# Altium schematic sheet TSevenSegmentDisplay.SchDoc: LiveDesign Evaluation - Alarm Clock
size A2; Organization: Altium Limited; Address1: L3, 12a Rodborough Rd; Address2: Frenchs Forest; Address3: NSW; Address4: Australia 2086; DocumentNumber: 9; SheetNumber: 9; SheetTotal: 10
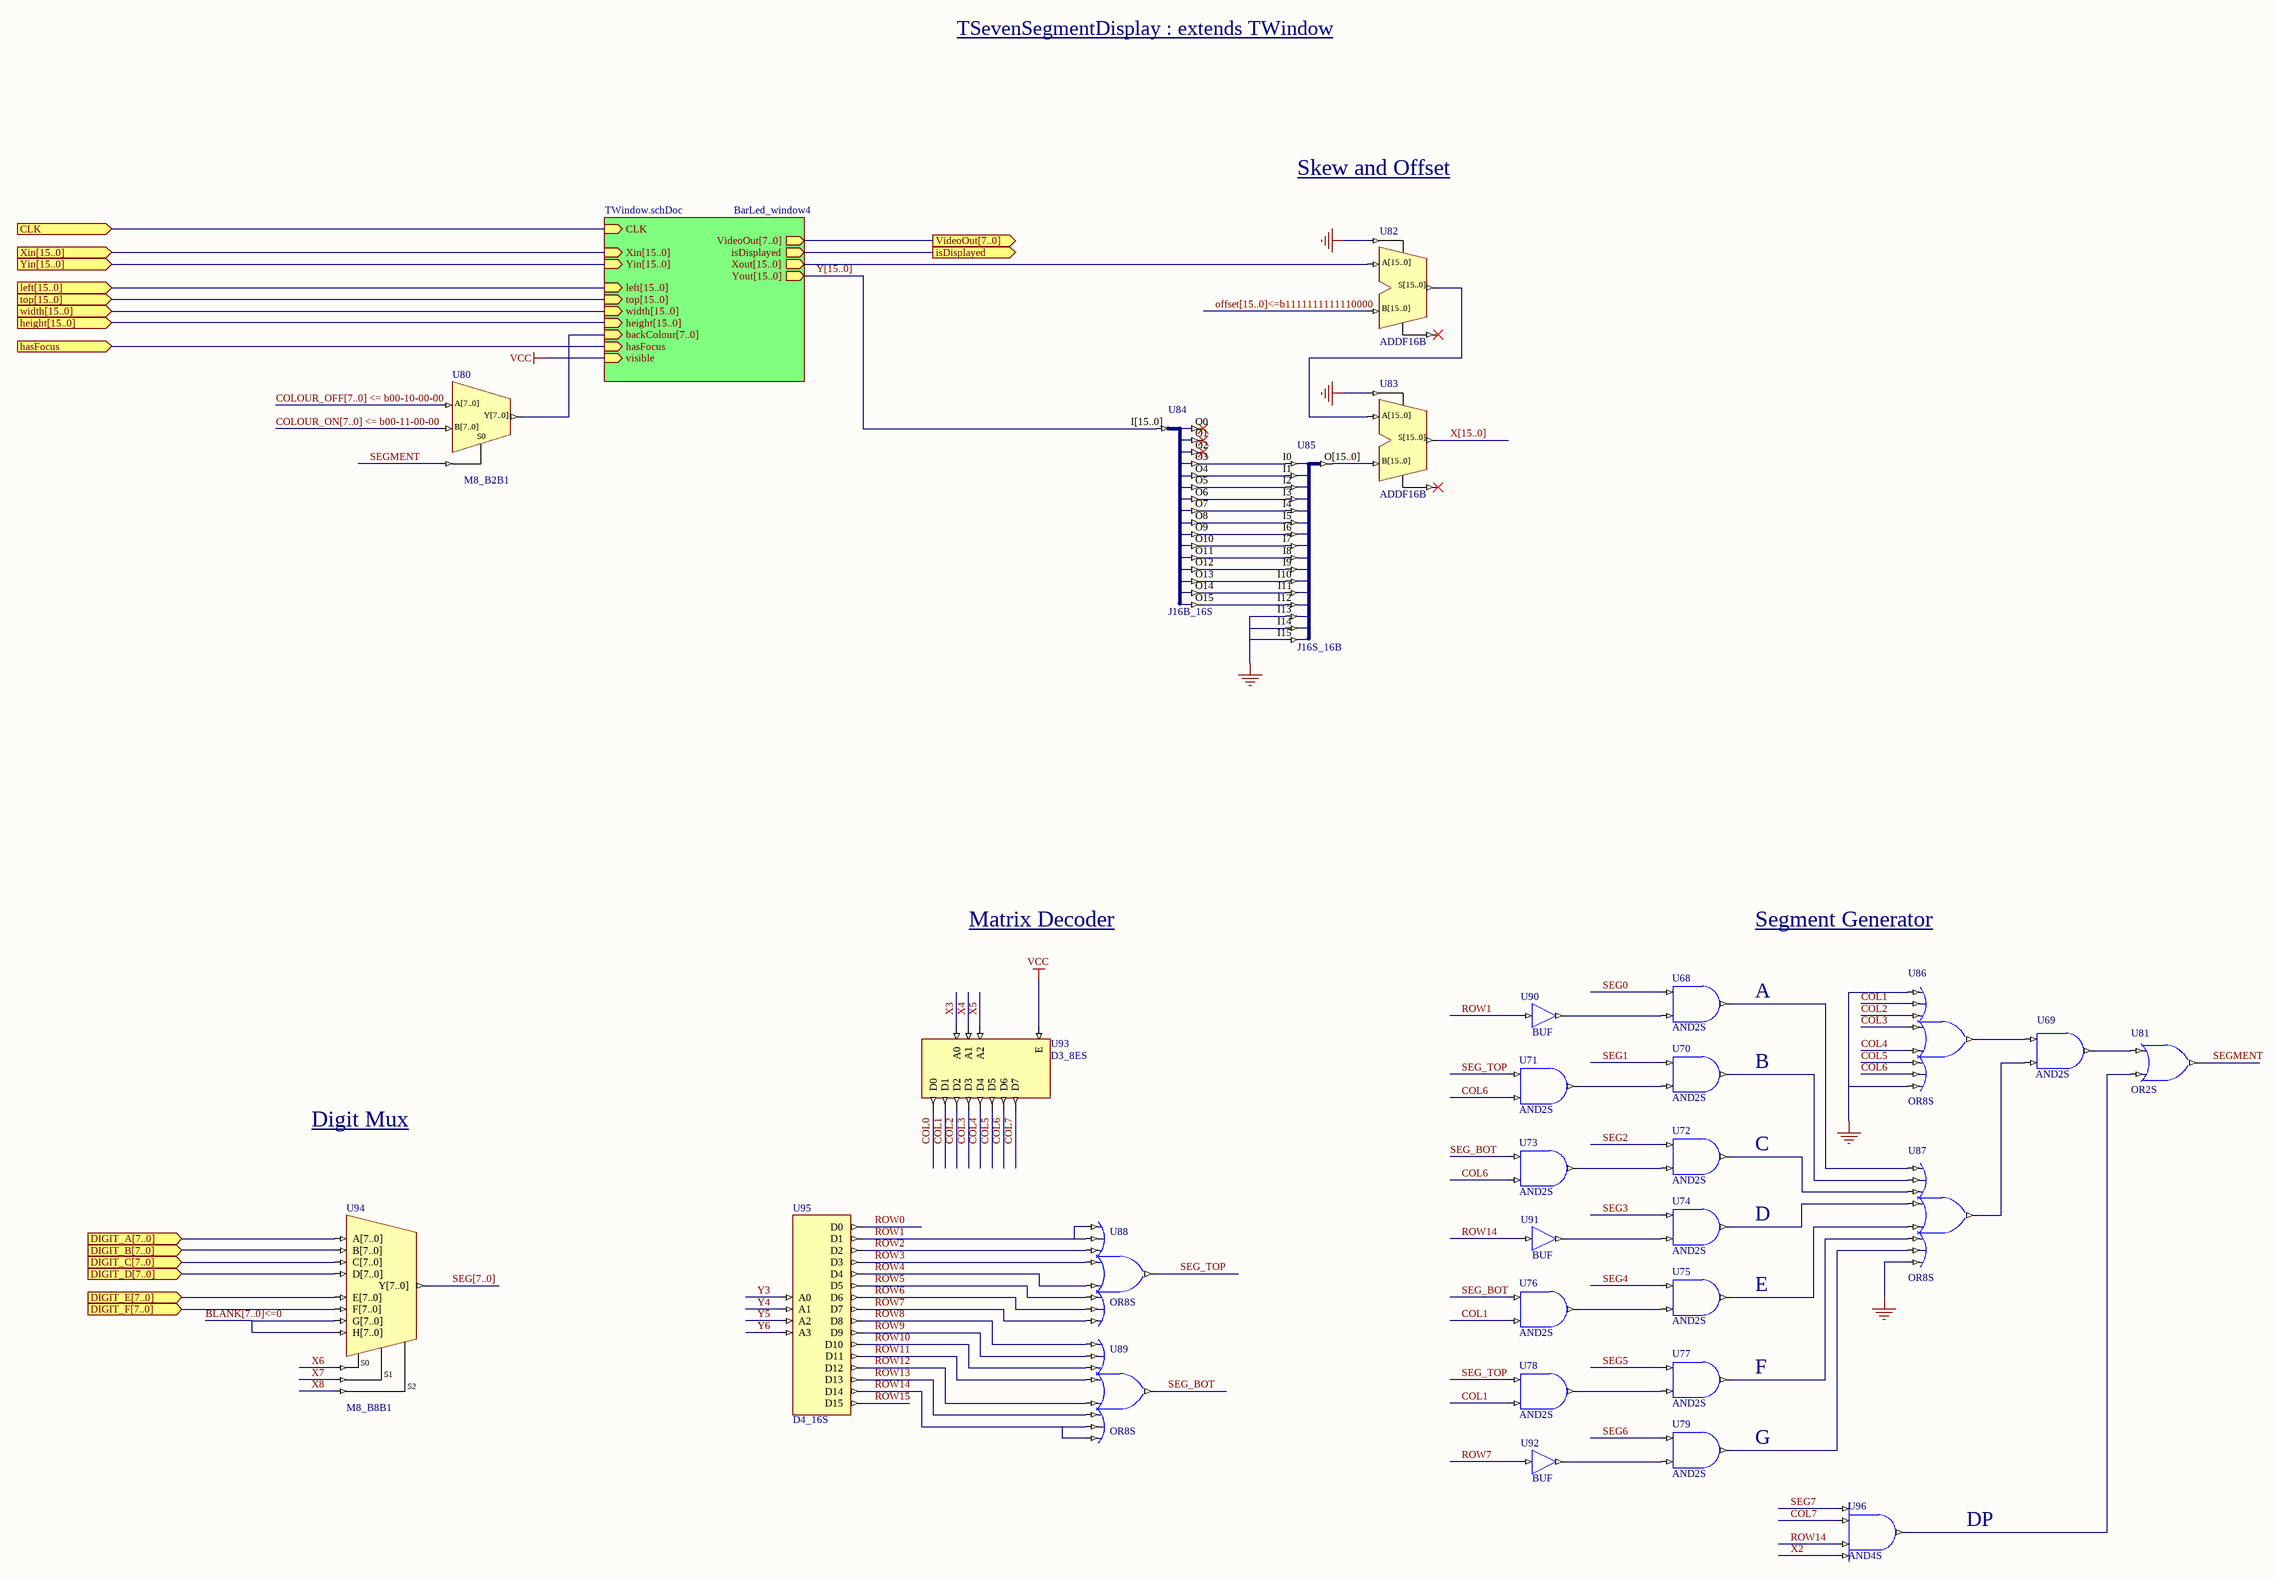
[diagram p0: TSevenSegmentDisplay.SchDoc]

## Parts
U68  AND2S
U69  AND2S
U70  AND2S
U71  AND2S
U72  AND2S
U73  AND2S
U74  AND2S
U75  AND2S
U76  AND2S
U77  AND2S
U78  AND2S
U79  AND2S
U80  M8_B2B1
U81  OR2S
U82  ADDF16B
U83  ADDF16B
U84  J16B_16S
U85  J16S_16B
U86  OR8S
U87  OR8S
U88  OR8S
U89  OR8S
U90  BUF
U91  BUF
U92  BUF
U93  D3_8ES
U94  M8_B8B1
U95  D4_16S
U96  AND4S

## Sub-sheets
BarLed_window4 = TWindow.schDoc: CLK (in), VideoOut[7..0] (out), Xin[15..0] (in), Yin[15..0] (in), top[15..0] (in), width[15..0] (in), height[15..0] (in), left[15..0] (in), Xout[15..0] (out), Yout[15..0] (out), backColour[7..0] (in), isDisplayed (out), visible (in), hasFocus (in)

## Ports
CLK (in), DIGIT_A[7..0] (in), DIGIT_B[7..0] (in), DIGIT_C[7..0] (in), DIGIT_D[7..0] (in), DIGIT_E[7..0] (in), DIGIT_F[7..0] (in), hasFocus (in), height[15..0] (in), isDisplayed (out), left[15..0] (in), top[15..0] (in), VideoOut[7..0] (out), width[15..0] (in), Xin[15..0] (in), Yin[15..0] (in)

## Nets
GND: U82.CI U83.CI U85.I13 U85.I14 U85.I15 U86.I0 U86.I7 U87.I7
VCC: U93.E ; sheet BarLed_window4/visible
BLANK[7..0]<=0: U94.G[7..0] U94.H[7..0]
CLK: port CLK, sheet BarLed_window4/CLK
COL0: U93.D0
COL1: U76.I1 U78.I1 U86.I1 U93.D1
COL2: U86.I2 U93.D2
COL3: U86.I3 U93.D3
COL4: U86.I4 U93.D4
COL5: U86.I5 U93.D5
COL6: U71.I1 U73.I1 U86.I6 U93.D6
COL7: U93.D7 U96.I1
COLOUR_OFF[7..0] <= b00-10-00-00: U80.A[7..0]
COLOUR_ON[7..0] <= b00-11-00-00: U80.B[7..0]
DIGIT_A[7..0]: U94.A[7..0] ; port DIGIT_A[7..0]
DIGIT_B[7..0]: U94.B[7..0] ; port DIGIT_B[7..0]
DIGIT_C[7..0]: U94.C[7..0] ; port DIGIT_C[7..0]
DIGIT_D[7..0]: U94.D[7..0] ; port DIGIT_D[7..0]
DIGIT_E[7..0]: U94.E[7..0] ; port DIGIT_E[7..0]
DIGIT_F[7..0]: U94.F[7..0] ; port DIGIT_F[7..0]
hasFocus: port hasFocus, sheet BarLed_window4/hasFocus
isDisplayed: port isDisplayed, sheet BarLed_window4/isDisplayed
offset[15..0]<=b1111111111110000: U82.B[15..0]
ROW0: U95.D0
ROW1: U88.I0 U88.I1 U90.I U95.D1
ROW2: U88.I2 U95.D2
ROW3: U88.I3 U95.D3
ROW4: U88.I4 U95.D4
ROW5: U88.I5 U95.D5
ROW6: U88.I6 U95.D6
ROW7: U88.I7 U92.I U95.D7
ROW8: U89.I0 U95.D8
ROW9: U89.I1 U95.D9
ROW10: U89.I2 U95.D10
ROW11: U89.I3 U95.D11
ROW12: U89.I4 U95.D12
ROW13: U89.I5 U95.D13
ROW14: U89.I6 U89.I7 U91.I U95.D14 U96.I2
ROW15: U95.D15
SEG0: U68.I0
SEG1: U70.I0
SEG2: U72.I0
SEG3: U74.I0
SEG4: U75.I0
SEG5: U77.I0
SEG6: U79.I0
SEG7: U96.I0
SEG[7..0]: U94.Y[7..0]
SEG_BOT: U73.I0 U76.I0 U89.O
SEG_TOP: U71.I0 U78.I0 U88.O
SEGMENT: U80.S0 U81.O
X2: U96.I3
X3: U93.A0
X4: U93.A1
X5: U93.A2
X6: U94.S0
X7: U94.S1
X8: U94.S2
X[15..0]: U83.S[15..0]
Y3: U95.A0
Y4: U95.A1
Y5: U95.A2
Y6: U95.A3
Y[15..0]: U84.I[15..0] ; sheet BarLed_window4/Yout[15..0]
NetU68_I1: U68.I1 U90.O
NetU68_O: U68.O U87.I0
NetU69_I0: U69.I0 U86.O
NetU69_I1: U69.I1 U87.O
NetU69_O: U69.O U81.I0
NetU70_I1: U70.I1 U71.O
NetU70_O: U70.O U87.I1
NetU72_I1: U72.I1 U73.O
NetU72_O: U72.O U87.I2
NetU74_I1: U74.I1 U91.O
NetU74_O: U74.O U87.I3
NetU75_I1: U75.I1 U76.O
NetU75_O: U75.O U87.I4
NetU77_I1: U77.I1 U78.O
NetU77_O: U77.O U87.I5
NetU79_I1: U79.I1 U92.O
NetU79_O: U79.O U87.I6
NetU80_Y[7..0]: U80.Y[7..0] ; sheet BarLed_window4/backColour[7..0]
NetU81_I1: U81.I1 U96.O
NetU82_A[15..0]: U82.A[15..0] ; sheet BarLed_window4/Xout[15..0]
NetU82_S[15..0]: U82.S[15..0] U83.A[15..0]
NetU83_B[15..0]: U83.B[15..0] U85.O[15..0]
NetU84_O3: U84.O3 U85.I0
NetU84_O4: U84.O4 U85.I1
NetU84_O5: U84.O5 U85.I2
NetU84_O6: U84.O6 U85.I3
NetU84_O7: U84.O7 U85.I4
NetU84_O8: U84.O8 U85.I5
NetU84_O9: U84.O9 U85.I6
NetU84_O10: U84.O10 U85.I7
NetU84_O11: U84.O11 U85.I8
NetU84_O12: U84.O12 U85.I9
NetU84_O13: U84.O13 U85.I10
NetU84_O14: U84.O14 U85.I11
NetU84_O15: U84.O15 U85.I12

Not connected (* = marked no-connect by the designer): U82 CO*; U83 CO*; U84 O0* O1* O2*

## Buses and harness runs
bus BLANK[7..0]<=0
bus COLOUR_OFF[7..0] <= b00-10-00-00
bus COLOUR_ON[7..0] <= b00-11-00-00
bus offset[15..0]<=b1111111111110000
bus port height[15..0] = sheet BarLed_window4/height[15..0]
bus port left[15..0] = sheet BarLed_window4/left[15..0]
bus port top[15..0] = sheet BarLed_window4/top[15..0]
bus port VideoOut[7..0] = sheet BarLed_window4/VideoOut[7..0]
bus port width[15..0] = sheet BarLed_window4/width[15..0]
bus port Xin[15..0] = sheet BarLed_window4/Xin[15..0]
bus port Yin[15..0] = sheet BarLed_window4/Yin[15..0]
bus SEG[7..0]
bus X[15..0]
bus Y[15..0] = sheet BarLed_window4/Yout[15..0]

## Notes on the sheet
- TSevenSegmentDisplay : extends TWindow
- Skew and Offset
- Matrix Decoder
- Segment Generator
- (near U68) A
- B
- Digit Mux
- (near U72) C
- D
- E
- (near U77) F
- G
- DP
- Title
- Size:
- Date:
- File:
- A2
- Number:
- Time:
- Revision:
- Sheet
- of

## Library data of the parts
U68-U79 = AND2S: 2-Input AND Gate, Single Pin Version; Xilinx Equivalent: AND2; ArchiveName: GENERIC; VHDLIB_SIM: GENERIC_LIB; Published: 29-Jan-2004; Publisher: Altium Limited; Core Revision: 1.00.00
U80 = M8_B2B1: 2x8-Bit Bus to 1x8-Bit Bus Multiplexer; ArchiveName: GENERIC; VHDLIB_SIM: GENERIC_LIB; Published: 29-Jan-2004; Publisher: Altium Limited; Core Revision: 1.00.00
U81 = OR2S: 2-Input OR Gate, Single Pin Version; Xilinx Equivalent: OR2; ArchiveName: GENERIC; VHDLIB_SIM: GENERIC_LIB; Published: 29-Jan-2004; Publisher: Altium Limited; Core Revision: 1.00.00
U82 U83 = ADDF16B: 16-Bit Cascadable Unsigned Binary Full Adder, Bus Version; ArchiveName: GENERIC; VHDLIB_SIM: GENERIC_LIB; Published: 31-May-2004; Publisher: Altium Limited; Core Revision: 1.00.00
U84 = J16B_16S: Single 16-Bit input bus to 16 single pin outputs; ArchiveName: GENERIC; VHDLIB_SIM: GENERIC_LIB; Published: 29-Jan-2004; Publisher: Altium Limited; Core Revision: 1.00.00
U85 = J16S_16B: 16 Single pin inputs to single 16-Bit output bus; ArchiveName: GENERIC; VHDLIB_SIM: GENERIC_LIB; Published: 29-Jan-2004; Publisher: Altium Limited; Core Revision: 1.00.00
U86-U89 = OR8S: 8-Input OR Gate, Single Pin Version; Xilinx Equivalent: OR8; ArchiveName: GENERIC; VHDLIB_SIM: GENERIC_LIB; Published: 29-Jan-2004; Publisher: Altium Limited; Core Revision: 1.00.00
U90-U92 = BUF: 1-bit General Purpose (Non-inverting) Buffer; ArchiveName: GENERIC; VHDLIB_SIM: GENERIC_LIB; Published: 29-Jan-2004; Publisher: Altium Limited; Xilinx Equivalent: BUF; Core Revision: 1.00.00
U93 = D3_8ES: Binary 3- to 8-Bit Decoder with Enable, Single Pin Version; Xilinx Equivalent: D3_8E; ArchiveName: GENERIC; VHDLIB_SIM: GENERIC_LIB; Published: 29-Jan-2004; Publisher: Altium Limited; Core Revision: 1.00.00
U94 = M8_B8B1: 8x8-Bit Bus to 1x8-Bit Bus Multiplexer; ArchiveName: GENERIC; VHDLIB_SIM: GENERIC_LIB; Published: 29-Jan-2004; Publisher: Altium Limited; Core Revision: 1.00.00
U95 = D4_16S: Binary 4- to 16-Bit Decoder, Single Pin Version; ArchiveName: GENERIC; VHDLIB_SIM: GENERIC_LIB; Published: 29-Jan-2004; Publisher: Altium Limited; Core Revision: 1.00.00
U96 = AND4S: 4-Input AND Gate, Single Pin Version; Xilinx Equivalent: AND4; ArchiveName: GENERIC; VHDLIB_SIM: GENERIC_LIB; Published: 29-Jan-2004; Publisher: Altium Limited; Core Revision: 1.00.00